# EAGLE schematic HYBRID_COMPUTER (EAGLE 7.7.0)

## Sheet 1 of 2
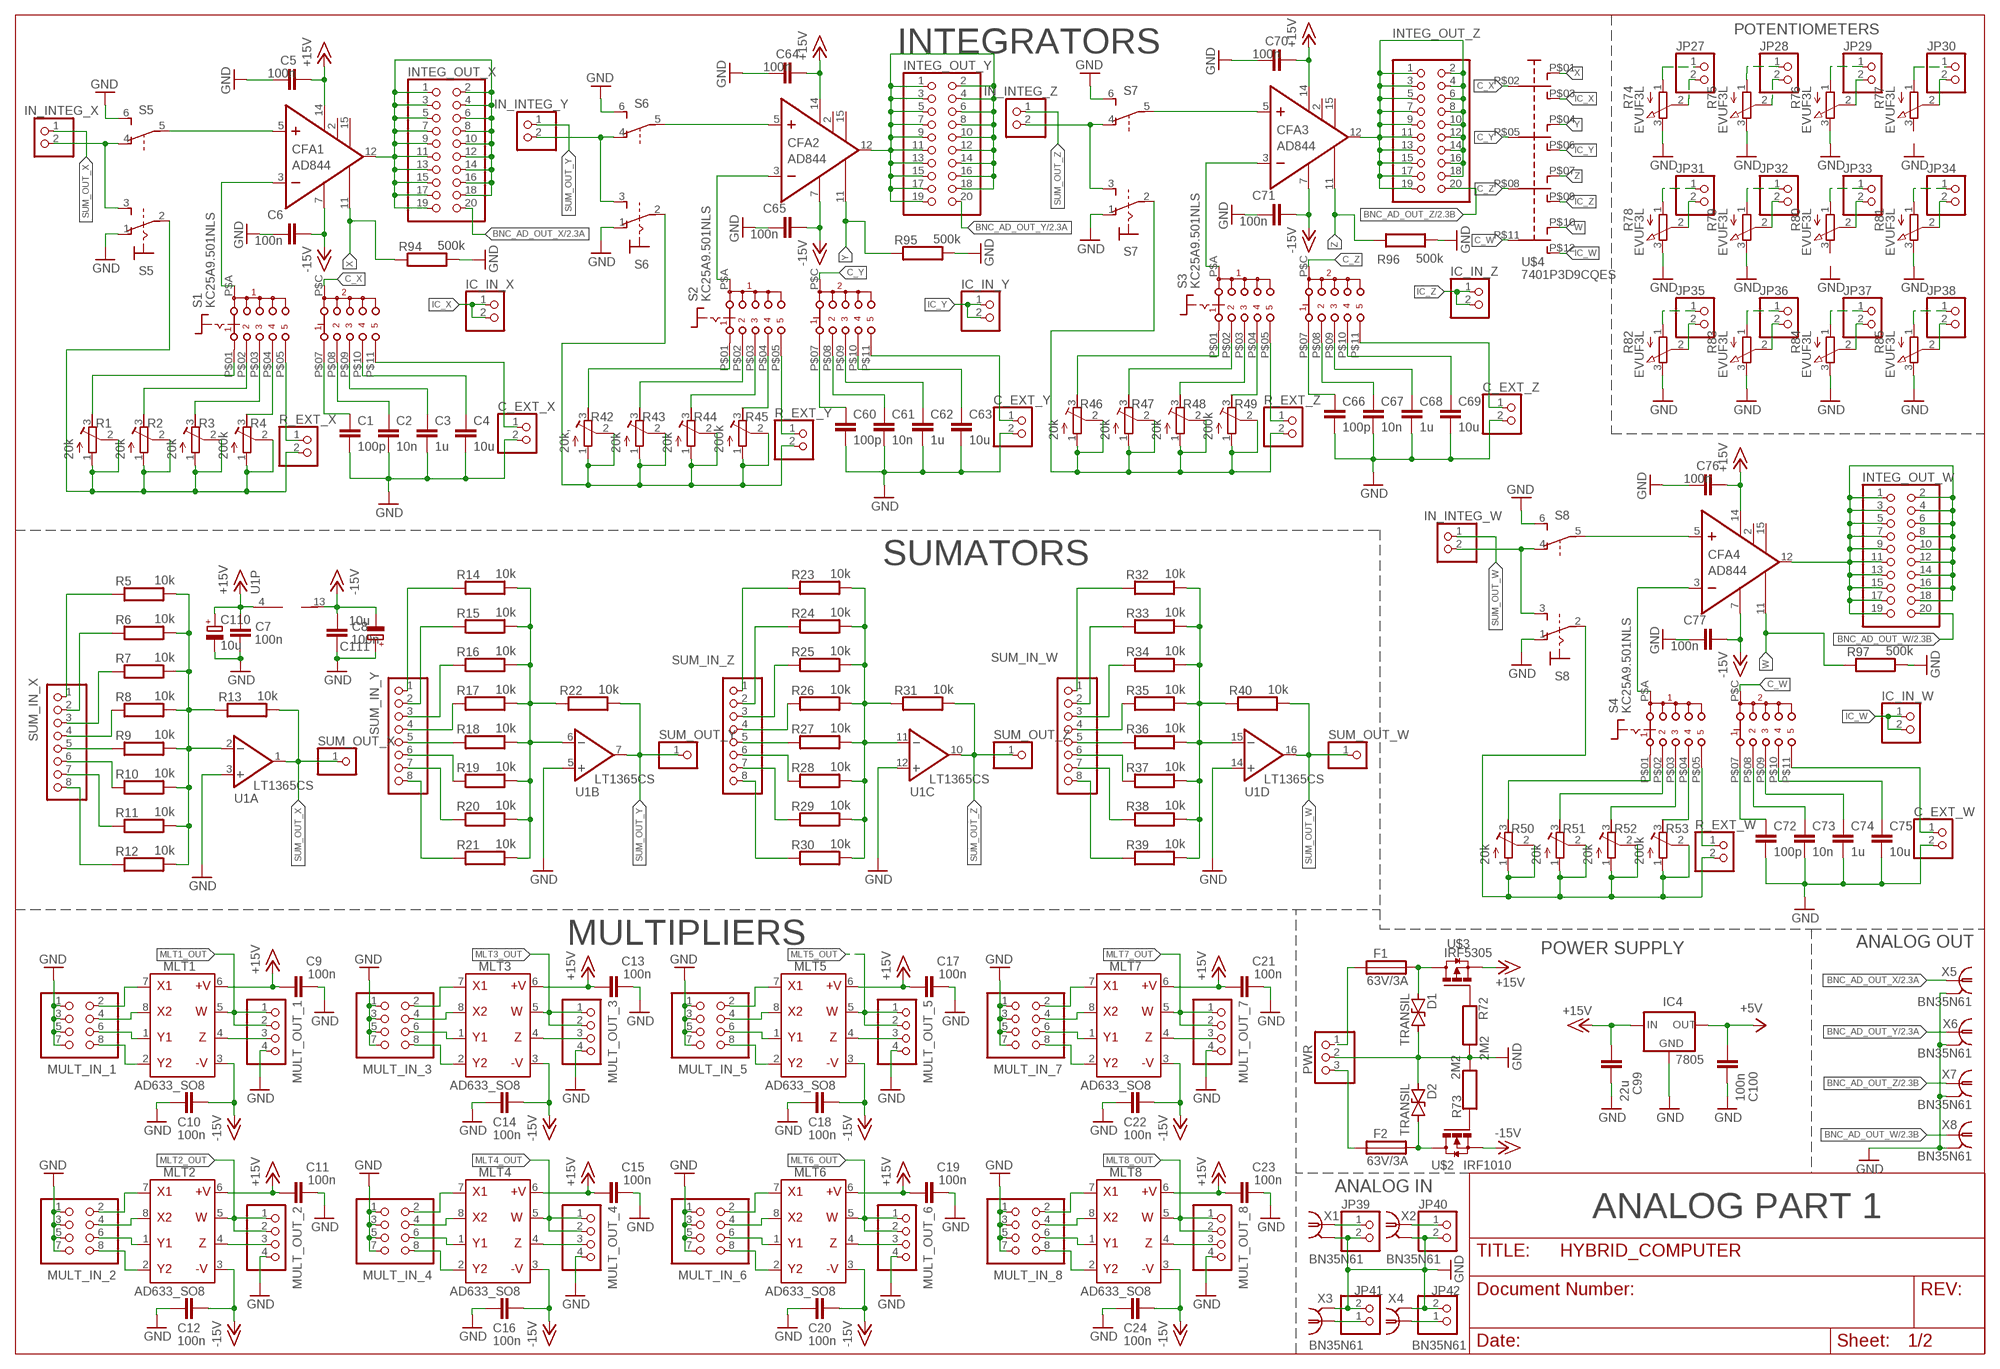
[diagram p0: schematic, sheet 1]

### Parts
C1  100p  C_1206  [C_1206]
C2  10n  C_1206  [C_1206]
C3  1u  C_1206  [C_1206]
C4  10u  C_1206  [C_1206]
C5  100n  C_1206  [C_1206]
C6  100n  C_1206  [C_1206]
C7  100n  C_1206  [C_1206]
C8  100n  C_1206  [C_1206]
C9  100n  C_1206  [C_1206]
C10  100n  C_1206  [C_1206]
C11  100n  C_1206  [C_1206]
C12  100n  C_1206  [C_1206]
C13  100n  C_1206  [C_1206]
C14  100n  C_1206  [C_1206]
C15  100n  C_1206  [C_1206]
C16  100n  C_1206  [C_1206]
C17  100n  C_1206  [C_1206]
C18  100n  C_1206  [C_1206]
C19  100n  C_1206  [C_1206]
C20  100n  C_1206  [C_1206]
C21  100n  C_1206  [C_1206]
C22  100n  C_1206  [C_1206]
C23  100n  C_1206  [C_1206]
C24  100n  C_1206  [C_1206]
C60  100p  C_1206  [C_1206]
C61  10n  C_1206  [C_1206]
C62  1u  C_1206  [C_1206]
C63  10u  C_1206  [C_1206]
C64  100n  C_1206  [C_1206]
C65  100n  C_1206  [C_1206]
C66  100p  C_1206  [C_1206]
C67  10n  C_1206  [C_1206]
C68  1u  C_1206  [C_1206]
C69  10u  C_1206  [C_1206]
C70  100n  C_1206  [C_1206]
C71  100n  C_1206  [C_1206]
C72  100p  C_1206  [C_1206]
C73  10n  C_1206  [C_1206]
C74  1u  C_1206  [C_1206]
C75  10u  C_1206  [C_1206]
C76  100n  C_1206  [C_1206]
C77  100n  C_1206  [C_1206]
C99  22u  C_1206  [C_1206]
C100  100n  C_1206  [C_1206]
C110  10u  CPOL-EUE2.5-5  [E2,5-5]
C111  10u  CPOL-EUE2.5-5  [E2,5-5]
C_EXT_W  PINHD-1X2  [1X02]
C_EXT_X  PINHD-1X2  [1X02]
C_EXT_Y  PINHD-1X2  [1X02]
C_EXT_Z  PINHD-1X2  [1X02]
CFA1  AD844  AD844_SOIC16R  [SOIC16R]
CFA2  AD844  AD844_SOIC16R  [SOIC16R]
CFA3  AD844  AD844_SOIC16R  [SOIC16R]
CFA4  AD844  AD844_SOIC16R  [SOIC16R]
D1  TRANSIL  [DO15-12]
D2  TRANSIL  [DO15-12]
F1  63V/3A  FUSE  [FUSE_1206]
F2  63V/3A  FUSE  [FUSE_1206]
IC4  7805  78MXXS  [78MXXS]
IC_IN_W  PINHD-1X2  [1X02]
IC_IN_X  PINHD-1X2  [1X02]
IC_IN_Y  PINHD-1X2  [1X02]
IC_IN_Z  PINHD-1X2  [1X02]
IN_INTEG_W  PINHD-1X2  [1X02]
IN_INTEG_X  PINHD-1X2  [1X02]
IN_INTEG_Y  PINHD-1X2  [1X02]
IN_INTEG_Z  PINHD-1X2  [1X02]
INTEG_OUT_W  PINHD-2X10  [2X10]
INTEG_OUT_X  PINHD-2X10  [2X10]
INTEG_OUT_Y  PINHD-2X10  [2X10]
INTEG_OUT_Z  PINHD-2X10  [2X10]
JP27  PINHD-1X2  [1X02]
JP28  PINHD-1X2  [1X02]
JP29  PINHD-1X2  [1X02]
JP30  PINHD-1X2  [1X02]
JP31  PINHD-1X2  [1X02]
JP32  PINHD-1X2  [1X02]
JP33  PINHD-1X2  [1X02]
JP34  PINHD-1X2  [1X02]
JP35  PINHD-1X2  [1X02]
JP36  PINHD-1X2  [1X02]
JP37  PINHD-1X2  [1X02]
JP38  PINHD-1X2  [1X02]
JP39  PINHD-1X2  [1X02]
JP40  PINHD-1X2  [1X02]
JP41  PINHD-1X2  [1X02]
JP42  PINHD-1X2  [1X02]
MLT1  AD633_SO8  [SO8]
MLT2  AD633_SO8  [SO8]
MLT3  AD633_SO8  [SO8]
MLT4  AD633_SO8  [SO8]
MLT5  AD633_SO8  [SO8]
MLT6  AD633_SO8  [SO8]
MLT7  AD633_SO8  [SO8]
MLT8  AD633_SO8  [SO8]
MULT_IN_1  PINHD-2X4  [2X04]
MULT_IN_2  PINHD-2X4  [2X04]
MULT_IN_3  PINHD-2X4  [2X04]
MULT_IN_4  PINHD-2X4  [2X04]
MULT_IN_5  PINHD-2X4  [2X04]
MULT_IN_6  PINHD-2X4  [2X04]
MULT_IN_7  PINHD-2X4  [2X04]
MULT_IN_8  PINHD-2X4  [2X04]
MULT_OUT_1  PINHD-1X4  [1X04]
MULT_OUT_2  PINHD-1X4  [1X04]
MULT_OUT_3  PINHD-1X4  [1X04]
MULT_OUT_4  PINHD-1X4  [1X04]
MULT_OUT_5  PINHD-1X4  [1X04]
MULT_OUT_6  PINHD-1X4  [1X04]
MULT_OUT_7  PINHD-1X4  [1X04]
MULT_OUT_8  PINHD-1X4  [1X04]
PWR  PINHD-1X3  [1X03]
R1  20k  R-TRIMM64W  [RTRIM64W]
R2  20k  R-TRIMM64W  [RTRIM64W]
R3  20k  R-TRIMM64W  [RTRIM64W]
R4  200k  R-TRIMM64W  [RTRIM64W]
R5  10k  R_1206  [R_1206]
R6  10k  R_1206  [R_1206]
R7  10k  R_1206  [R_1206]
R8  10k  R_1206  [R_1206]
R9  10k  R_1206  [R_1206]
R10  10k  R_1206  [R_1206]
R11  10k  R_1206  [R_1206]
R12  10k  R_1206  [R_1206]
R13  10k  R_1206  [R_1206]
R14  10k  R_1206  [R_1206]
R15  10k  R_1206  [R_1206]
R16  10k  R_1206  [R_1206]
R17  10k  R_1206  [R_1206]
R18  10k  R_1206  [R_1206]
R19  10k  R_1206  [R_1206]
R20  10k  R_1206  [R_1206]
R21  10k  R_1206  [R_1206]
R22  10k  R_1206  [R_1206]
R23  10k  R_1206  [R_1206]
R24  10k  R_1206  [R_1206]
R25  10k  R_1206  [R_1206]
R26  10k  R_1206  [R_1206]
R27  10k  R_1206  [R_1206]
R28  10k  R_1206  [R_1206]
R29  10k  R_1206  [R_1206]
R30  10k  R_1206  [R_1206]
R31  10k  R_1206  [R_1206]
R32  10k  R_1206  [R_1206]
R33  10k  R_1206  [R_1206]
R34  10k  R_1206  [R_1206]
R35  10k  R_1206  [R_1206]
R36  10k  R_1206  [R_1206]
R37  10k  R_1206  [R_1206]
R38  10k  R_1206  [R_1206]
R39  10k  R_1206  [R_1206]
R40  10k  R_1206  [R_1206]
R42  20k,  R-TRIMM64W  [RTRIM64W]
R43  20k  R-TRIMM64W  [RTRIM64W]
R44  20k  R-TRIMM64W  [RTRIM64W]
R45  200k  R-TRIMM64W  [RTRIM64W]
R46  20k  R-TRIMM64W  [RTRIM64W]
R47  20k  R-TRIMM64W  [RTRIM64W]
R48  20k  R-TRIMM64W  [RTRIM64W]
R49  200k  R-TRIMM64W  [RTRIM64W]
R50  20k  R-TRIMM64W  [RTRIM64W]
R51  20k  R-TRIMM64W  [RTRIM64W]
R52  20k  R-TRIMM64W  [RTRIM64W]
R53  200k  R-TRIMM64W  [RTRIM64W]
R72  2M2  R_1206  [R_1206]
R73  2M2  R_1206  [R_1206]
R74  EVUF3L  [EVUFXL]
R75  EVUF3L  [EVUFXL]
R76  EVUF3L  [EVUFXL]
R77  EVUF3L  [EVUFXL]
R78  EVUF3L  [EVUFXL]
R79  EVUF3L  [EVUFXL]
R80  EVUF3L  [EVUFXL]
R81  EVUF3L  [EVUFXL]
R82  EVUF3L  [EVUFXL]
R83  EVUF3L  [EVUFXL]
R84  EVUF3L  [EVUFXL]
R85  EVUF3L  [EVUFXL]
R94  500k  R_1206  [R_1206]
R95  500k  R_1206  [R_1206]
R96  500k  R_1206  [R_1206]
R97  500k  R_1206  [R_1206]
R_EXT_W  PINHD-1X2  [1X02]
R_EXT_X  PINHD-1X2  [1X02]
R_EXT_Y  PINHD-1X2  [1X02]
R_EXT_Z  PINHD-1X2  [1X02]
S1  KC25A9.501NLS  [KC25A9.501NLS]
S2  KC25A9.501NLS  [KC25A9.501NLS]
S3  KC25A9.501NLS  [KC25A9.501NLS]
S4  KC25A9.501NLS  [KC25A9.501NLS]
S5  320-938  [320-938]
S6  320-938  [320-938]
S7  320-938  [320-938]
S8  320-938  [320-938]
SUM_IN_W  PINHD-1X8  [1X08]
SUM_IN_X  PINHD-1X8  [1X08]
SUM_IN_Y  PINHD-1X8  [1X08]
SUM_IN_Z  PINHD-1X8  [1X08]
SUM_OUT_W  PINHD-1X1  [1X01]
SUM_OUT_X  PINHD-1X1  [1X01]
SUM_OUT_Y  PINHD-1X1  [1X01]
SUM_OUT_Z  PINHD-1X1  [1X01]
U1  LT1365CS  [SO16]
U$2  IRF1010  [TO220BV]
U$3  IRF5305  [TO220BV]
U$4  7401P3D9CQES  [7401P3D9CQES]
X1  BN35N61  [B35N61]
X2  BN35N61  [B35N61]
X3  BN35N61  [B35N61]
X4  BN35N61  [B35N61]
X5  BN35N61  [B35N61]
X6  BN35N61  [B35N61]
X7  BN35N61  [B35N61]
X8  BN35N61  [B35N61]

### Nets
+5V: C100.1 IC4.OUT ; also sheet 2
+15V: C5.1 C7.1 C9.1 C11.1 C13.1 C15.1 C17.1 C19.1 C21.1 C23.1 C64.1 C70.1 C76.1 C99.1 C110.+ CFA1.14 CFA2.14 CFA3.14 CFA4.14 IC4.IN MLT1.6 MLT2.6 MLT3.6 MLT4.6 MLT5.6 MLT6.6 MLT7.6 MLT8.6 U1.4(P:V+) U$3.S ; also sheet 2
-15V: C6.1 C8.1 C10.1 C12.1 C14.1 C16.1 C18.1 C20.1 C22.1 C24.1 C65.1 C71.1 C77.1 C111.- CFA1.7 CFA2.7 CFA3.7 CFA4.7 MLT1.3 MLT2.3 MLT3.3 MLT4.3 MLT5.3 MLT6.3 MLT7.3 MLT8.3 U1.13(P:V-) U$2.S ; also sheet 2
BNC_AD_OUT_W: INTEG_OUT_W.20 X8.1 ; also sheet 2
BNC_AD_OUT_X: INTEG_OUT_X.20 X5.1 ; also sheet 2
BNC_AD_OUT_Y: INTEG_OUT_Y.20 X6.1 ; also sheet 2
BNC_AD_OUT_Z: INTEG_OUT_Z.20 X7.1 ; also sheet 2
C_W: S4.P$C(C) U$4.P$11
C_X: S1.P$C(C) U$4.P$02
C_Y: S2.P$C(C) U$4.P$05
C_Z: S3.P$C(C) U$4.P$08
GND: C1.2 C2.2 C3.2 C4.2 C5.2 C6.2 C7.2 C8.2 C9.2 C10.2 C11.2 C12.2 C13.2 C14.2 C15.2 C16.2 C17.2 C18.2 C19.2 C20.2 C21.2 C22.2 C23.2 C24.2 C60.2 C61.2 C62.2 C63.2 C64.2 C65.2 C66.2 C67.2 C68.2 C69.2 C70.2 C71.2 C72.2 C73.2 C74.2 C75.2 C76.2 C77.2 C99.2 C100.2 C110.- C111.+ C_EXT_W.2 C_EXT_X.2 C_EXT_Y.2 C_EXT_Z.2 D1.C D2.A IC4.GND JP39.2 JP40.2 JP41.2 JP42.2 MULT_IN_1.1 MULT_IN_1.3 MULT_IN_1.5 MULT_IN_1.7 MULT_IN_2.1 MULT_IN_2.3 MULT_IN_2.5 MULT_IN_2.7 MULT_IN_3.1 MULT_IN_3.3 MULT_IN_3.5 MULT_IN_3.7 MULT_IN_4.1 MULT_IN_4.3 MULT_IN_4.5 MULT_IN_4.7 MULT_IN_5.1 MULT_IN_5.3 MULT_IN_5.5 MULT_IN_5.7 MULT_IN_6.1 MULT_IN_6.3 MULT_IN_6.5 MULT_IN_6.7 MULT_IN_7.1 MULT_IN_7.3 MULT_IN_7.5 MULT_IN_7.7 MULT_IN_8.1 MULT_IN_8.3 MULT_IN_8.5 MULT_IN_8.7 MULT_OUT_1.4 MULT_OUT_2.4 MULT_OUT_3.4 MULT_OUT_4.4 MULT_OUT_5.4 MULT_OUT_6.4 MULT_OUT_7.4 MULT_OUT_8.4 PWR.2 R72.2 R73.2 R74.3(E) R75.3(E) R76.3(E) R78.3(E) R79.3(E) R81.3(E) R82.3(E) R83.3(E) R84.3(E) R85.3(E) R94.2 R95.2 R96.2 R97.2 S5.1(1:O) S5.6(B:S) S6.1(1:O) S6.6(B:S) S7.1(1:O) S7.6(B:S) S8.1(1:O) S8.6(B:S) U1.3(A:+IN) U1.5(B:+IN) U1.12(C:+IN) U1.14(D:+IN) X1.2 X1.3 X1.4 X1.5 X2.2 X2.3 X2.4 X2.5 X3.2 X3.3 X3.4 X3.5 X4.2 X4.3 X4.4 X4.5 X5.2 X5.3 X5.4 X5.5 X6.2 X6.3 X6.4 X6.5 X7.2 X7.3 X7.4 X7.5 X8.2 X8.3 X8.4 X8.5 ; also sheet 2
IC_W: IC_IN_W.1 IC_IN_W.2 U$4.P$12
IC_X: IC_IN_X.1 IC_IN_X.2 U$4.P$03
IC_Y: IC_IN_Y.1 IC_IN_Y.2 U$4.P$06
IC_Z: IC_IN_Z.1 IC_IN_Z.2 U$4.P$09
INTEG_OUT_W: CFA4.12 INTEG_OUT_W.1 INTEG_OUT_W.2 INTEG_OUT_W.3 INTEG_OUT_W.4 INTEG_OUT_W.5 INTEG_OUT_W.6 INTEG_OUT_W.7 INTEG_OUT_W.8 INTEG_OUT_W.9 INTEG_OUT_W.10 INTEG_OUT_W.11 INTEG_OUT_W.12 INTEG_OUT_W.13 INTEG_OUT_W.14 INTEG_OUT_W.15 INTEG_OUT_W.16 INTEG_OUT_W.17 INTEG_OUT_W.18 INTEG_OUT_W.19
INTEG_OUT_Y: CFA2.12 INTEG_OUT_Y.1 INTEG_OUT_Y.2 INTEG_OUT_Y.3 INTEG_OUT_Y.4 INTEG_OUT_Y.5 INTEG_OUT_Y.6 INTEG_OUT_Y.7 INTEG_OUT_Y.8 INTEG_OUT_Y.9 INTEG_OUT_Y.10 INTEG_OUT_Y.11 INTEG_OUT_Y.12 INTEG_OUT_Y.13 INTEG_OUT_Y.14 INTEG_OUT_Y.15 INTEG_OUT_Y.16 INTEG_OUT_Y.17 INTEG_OUT_Y.18 INTEG_OUT_Y.19
INTEG_OUT_Z: CFA3.12 INTEG_OUT_Z.1 INTEG_OUT_Z.2 INTEG_OUT_Z.3 INTEG_OUT_Z.4 INTEG_OUT_Z.5 INTEG_OUT_Z.6 INTEG_OUT_Z.7 INTEG_OUT_Z.8 INTEG_OUT_Z.9 INTEG_OUT_Z.10 INTEG_OUT_Z.11 INTEG_OUT_Z.12 INTEG_OUT_Z.13 INTEG_OUT_Z.14 INTEG_OUT_Z.15 INTEG_OUT_Z.16 INTEG_OUT_Z.17 INTEG_OUT_Z.18 INTEG_OUT_Z.19
MLT1_OUT: MLT1.5 MULT_OUT_1.1 MULT_OUT_1.2
MLT2_OUT: MLT2.5 MULT_OUT_2.1 MULT_OUT_2.2
MLT3_OUT: MLT3.5 MULT_OUT_3.1 MULT_OUT_3.2
MLT4_OUT: MLT4.5 MULT_OUT_4.1 MULT_OUT_4.2
MLT5_OUT: MLT5.5 MULT_OUT_5.1 MULT_OUT_5.2
MLT6_OUT: MLT6.5 MULT_OUT_6.1 MULT_OUT_6.2
MLT7_OUT: MLT7.5 MULT_OUT_7.1 MULT_OUT_7.2
MLT8_OUT: MLT8.5 MULT_OUT_8.1 MULT_OUT_8.2
N$1: R1.1(A) R1.2(S) R2.1(A) R2.2(S) R3.1(A) R3.2(S) R4.1(A) R4.2(S) R_EXT_X.2 S5.2(1:P)
N$2: CFA1.5 S5.5(B:P)
N$3: CFA1.3 S1.P$A(A)
N$4: IN_INTEG_X.2 S5.3(1:S) S5.4(B:O)
N$6: R4.3(E) S1.P$04
N$8: R1.3(E) S1.P$01
N$9: R2.3(E) S1.P$02
N$10: R3.3(E) S1.P$03
N$11: C1.1 S1.P$07
N$12: R5.2 R6.2 R7.2 R8.2 R9.2 R10.2 R11.2 R12.2 R13.1 U1.2(A:-IN)
N$13: C4.1 S1.P$10
N$14: C3.1 S1.P$09
N$15: C2.1 S1.P$08
N$17: R_EXT_X.1 S1.P$05
N$19: R9.1 SUM_IN_X.5
N$20: C_EXT_X.1 S1.P$11
N$21: R10.1 SUM_IN_X.6
N$22: R11.1 SUM_IN_X.7
N$23: R12.1 SUM_IN_X.8
N$24: R8.1 SUM_IN_X.4
N$25: R7.1 SUM_IN_X.3
N$26: R6.1 SUM_IN_X.2
N$27: R5.1 SUM_IN_X.1
N$28: R14.2 R15.2 R16.2 R17.2 R18.2 R19.2 R20.2 R21.2 R22.1 U1.6(B:-IN)
N$29: JP29.2 R76.2(S)
N$30: R18.1 SUM_IN_Y.5
N$31: R19.1 SUM_IN_Y.6
N$32: R20.1 SUM_IN_Y.7
N$33: R21.1 SUM_IN_Y.8
N$34: R17.1 SUM_IN_Y.4
N$35: R16.1 SUM_IN_Y.3
N$36: R15.1 SUM_IN_Y.2
N$37: R14.1 SUM_IN_Y.1
N$38: R23.2 R24.2 R25.2 R26.2 R27.2 R28.2 R29.2 R30.2 R31.1 U1.11(C:-IN)
N$39: MLT1.7 MULT_IN_1.2
N$40: R27.1 SUM_IN_Z.5
N$41: R28.1 SUM_IN_Z.6
N$42: R29.1 SUM_IN_Z.7
N$43: R30.1 SUM_IN_Z.8
N$44: R26.1 SUM_IN_Z.4
N$45: R25.1 SUM_IN_Z.3
N$46: R24.1 SUM_IN_Z.2
N$47: R23.1 SUM_IN_Z.1
N$48: R32.2 R33.2 R34.2 R35.2 R36.2 R37.2 R38.2 R39.2 R40.1 U1.15(D:-IN)
N$50: R36.1 SUM_IN_W.5
N$51: R37.1 SUM_IN_W.6
N$52: R38.1 SUM_IN_W.7
N$53: R39.1 SUM_IN_W.8
N$54: R35.1 SUM_IN_W.4
N$55: R34.1 SUM_IN_W.3
N$56: R33.1 SUM_IN_W.2
N$57: R32.1 SUM_IN_W.1
N$59: MLT1.4 MULT_OUT_1.3
N$60: MLT1.8 MULT_IN_1.4
N$61: MLT1.1 MULT_IN_1.6
N$62: MLT1.2 MULT_IN_1.8
N$64: MLT2.4 MULT_OUT_2.3
N$65: MLT2.7 MULT_IN_2.2
N$66: MLT2.8 MULT_IN_2.4
N$67: MLT2.1 MULT_IN_2.6
N$68: MLT2.2 MULT_IN_2.8
N$70: MLT3.4 MULT_OUT_3.3
N$71: MLT3.7 MULT_IN_3.2
N$72: MLT3.8 MULT_IN_3.4
N$73: MLT3.1 MULT_IN_3.6
N$74: MLT3.2 MULT_IN_3.8
N$75: R46.1(A) R46.2(S) R47.1(A) R47.2(S) R48.1(A) R48.2(S) R49.1(A) R49.2(S) R_EXT_Z.2 S7.2(1:P)
N$76: MLT4.4 MULT_OUT_4.3
N$77: MLT4.7 MULT_IN_4.2
N$78: MLT4.8 MULT_IN_4.4
N$79: MLT4.1 MULT_IN_4.6
N$80: MLT4.2 MULT_IN_4.8
N$82: MLT5.4 MULT_OUT_5.3
N$83: MLT5.7 MULT_IN_5.2
N$84: MLT5.8 MULT_IN_5.4
N$85: MLT5.1 MULT_IN_5.6
N$86: MLT5.2 MULT_IN_5.8
N$88: MLT6.4 MULT_OUT_6.3
N$89: MLT6.7 MULT_IN_6.2
N$90: MLT6.8 MULT_IN_6.4
N$91: MLT6.1 MULT_IN_6.6
N$92: MLT6.2 MULT_IN_6.8
N$94: MLT7.4 MULT_OUT_7.3
N$95: MLT7.7 MULT_IN_7.2
N$96: MLT7.8 MULT_IN_7.4
N$97: MLT7.1 MULT_IN_7.6
N$98: MLT7.2 MULT_IN_7.8
N$100: MLT8.4 MULT_OUT_8.3
N$101: MLT8.7 MULT_IN_8.2
N$102: MLT8.8 MULT_IN_8.4
N$103: MLT8.1 MULT_IN_8.6
N$104: MLT8.2 MULT_IN_8.8
N$106: JP27.1 R74.1(A)
N$107: JP27.2 R74.2(S)
N$108: JP28.2 R75.2(S)
N$109: JP28.1 R75.1(A)
N$110: JP29.1 R76.1(A)
N$112: JP30.1 R77.1(A)
N$113: JP30.2 R77.2(S)
N$114: JP34.1 R81.1(A)
N$115: JP34.2 R81.2(S)
N$116: JP33.2 R80.2(S)
N$117: JP33.1 R80.1(A)
N$118: JP32.1 R79.1(A)
N$119: JP32.2 R79.2(S)
N$120: JP31.1 R78.1(A)
N$121: JP31.2 R78.2(S)
N$122: JP35.1 R82.1(A)
N$123: JP35.2 R82.2(S)
N$124: JP36.1 R83.1(A)
N$125: JP36.2 R83.2(S)
N$126: JP37.1 R84.1(A)
N$127: JP37.2 R84.2(S)
N$128: JP38.1 R85.1(A)
N$129: JP38.2 R85.2(S)
N$133: D1.A F1.2 U$3.D
N$141: R42.1(A) R42.2(S) R43.1(A) R43.2(S) R44.1(A) R44.2(S) R45.1(A) R45.2(S) R_EXT_Y.2 S6.2(1:P)
N$142: CFA2.5 S6.5(B:P)
N$143: CFA2.3 S2.P$A(A)
N$144: IN_INTEG_Y.2 S6.3(1:S) S6.4(B:O)
N$145: R42.3(E) S2.P$01
N$146: R43.3(E) S2.P$02
N$147: R44.3(E) S2.P$03
N$148: C63.1 S2.P$10
N$149: C62.1 S2.P$09
N$150: C61.1 S2.P$08
N$153: CFA1.12 INTEG_OUT_X.1 INTEG_OUT_X.2 INTEG_OUT_X.3 INTEG_OUT_X.4 INTEG_OUT_X.5 INTEG_OUT_X.6 INTEG_OUT_X.7 INTEG_OUT_X.8 INTEG_OUT_X.9 INTEG_OUT_X.10 INTEG_OUT_X.11 INTEG_OUT_X.12 INTEG_OUT_X.13 INTEG_OUT_X.14 INTEG_OUT_X.15 INTEG_OUT_X.16 INTEG_OUT_X.17 INTEG_OUT_X.18 INTEG_OUT_X.19
N$154: R45.3(E) S2.P$04
N$155: C60.1 S2.P$07
N$156: R_EXT_Y.1 S2.P$05
N$157: C_EXT_Y.1 S2.P$11
N$159: CFA3.5 S7.5(B:P)
N$160: CFA3.3 S3.P$A(A)
N$161: IN_INTEG_Z.2 S7.3(1:S) S7.4(B:O)
N$162: R46.3(E) S3.P$01
N$163: R47.3(E) S3.P$02
N$164: R48.3(E) S3.P$03
N$165: C69.1 S3.P$10
N$166: C68.1 S3.P$09
N$167: C67.1 S3.P$08
N$171: R49.3(E) S3.P$04
N$172: C66.1 S3.P$07
N$173: R_EXT_Z.1 S3.P$05
N$174: C_EXT_Z.1 S3.P$11
N$175: R50.1(A) R50.2(S) R51.1(A) R51.2(S) R52.1(A) R52.2(S) R53.1(A) R53.2(S) R_EXT_W.2 S8.2(1:P)
N$176: CFA4.5 S8.5(B:P)
N$177: CFA4.3 S4.P$A(A)
N$178: IN_INTEG_W.2 S8.3(1:S) S8.4(B:O)
N$179: R50.3(E) S4.P$01
N$180: R51.3(E) S4.P$02
N$181: R52.3(E) S4.P$03
N$182: C75.1 S4.P$10
N$183: C74.1 S4.P$09
N$184: C73.1 S4.P$08
N$188: R53.3(E) S4.P$04
N$189: C72.1 S4.P$07
N$190: R_EXT_W.1 S4.P$05
N$191: C_EXT_W.1 S4.P$11
N$202: F2.1 PWR.3
N$203: F1.1 PWR.1
N$204: JP39.1 X1.1
N$206: JP40.1 X2.1
N$208: JP41.1 X3.1
N$210: JP42.1 X4.1
N$220: D2.C F2.2 U$2.D
N$222: R72.1 U$3.G
N$223: R73.1 U$2.G
SUM_OUT_W: IN_INTEG_W.1 R40.2 SUM_OUT_W.1 U1.16(D:OUT)
SUM_OUT_X: IN_INTEG_X.1 R13.2 SUM_OUT_X.1 U1.1(A:OUT)
SUM_OUT_Y: IN_INTEG_Y.1 R22.2 SUM_OUT_Y.1 U1.7(B:OUT)
SUM_OUT_Z: IN_INTEG_Z.1 R31.2 SUM_OUT_Z.1 U1.10(C:OUT)
W: CFA4.11 R97.1 U$4.P$10
X: CFA1.11 R94.1 U$4.P$01
Y: CFA2.11 R95.1 U$4.P$04
Z: CFA3.11 R96.1 U$4.P$07
Unconnected: CFA1.2 CFA1.15 CFA2.2 CFA2.15 CFA3.2 CFA3.15 CFA4.2 CFA4.15 R77.3(E) R80.3(E)

### Notes on the sheet
- POTENTIOMETERS
- INTEGRATORS
- SUMATORS
- MULTIPLIERS | ANALOG OUT
- POWER SUPPLY
- ANALOG IN
- ANALOG PART 1

## Sheet 2 of 2
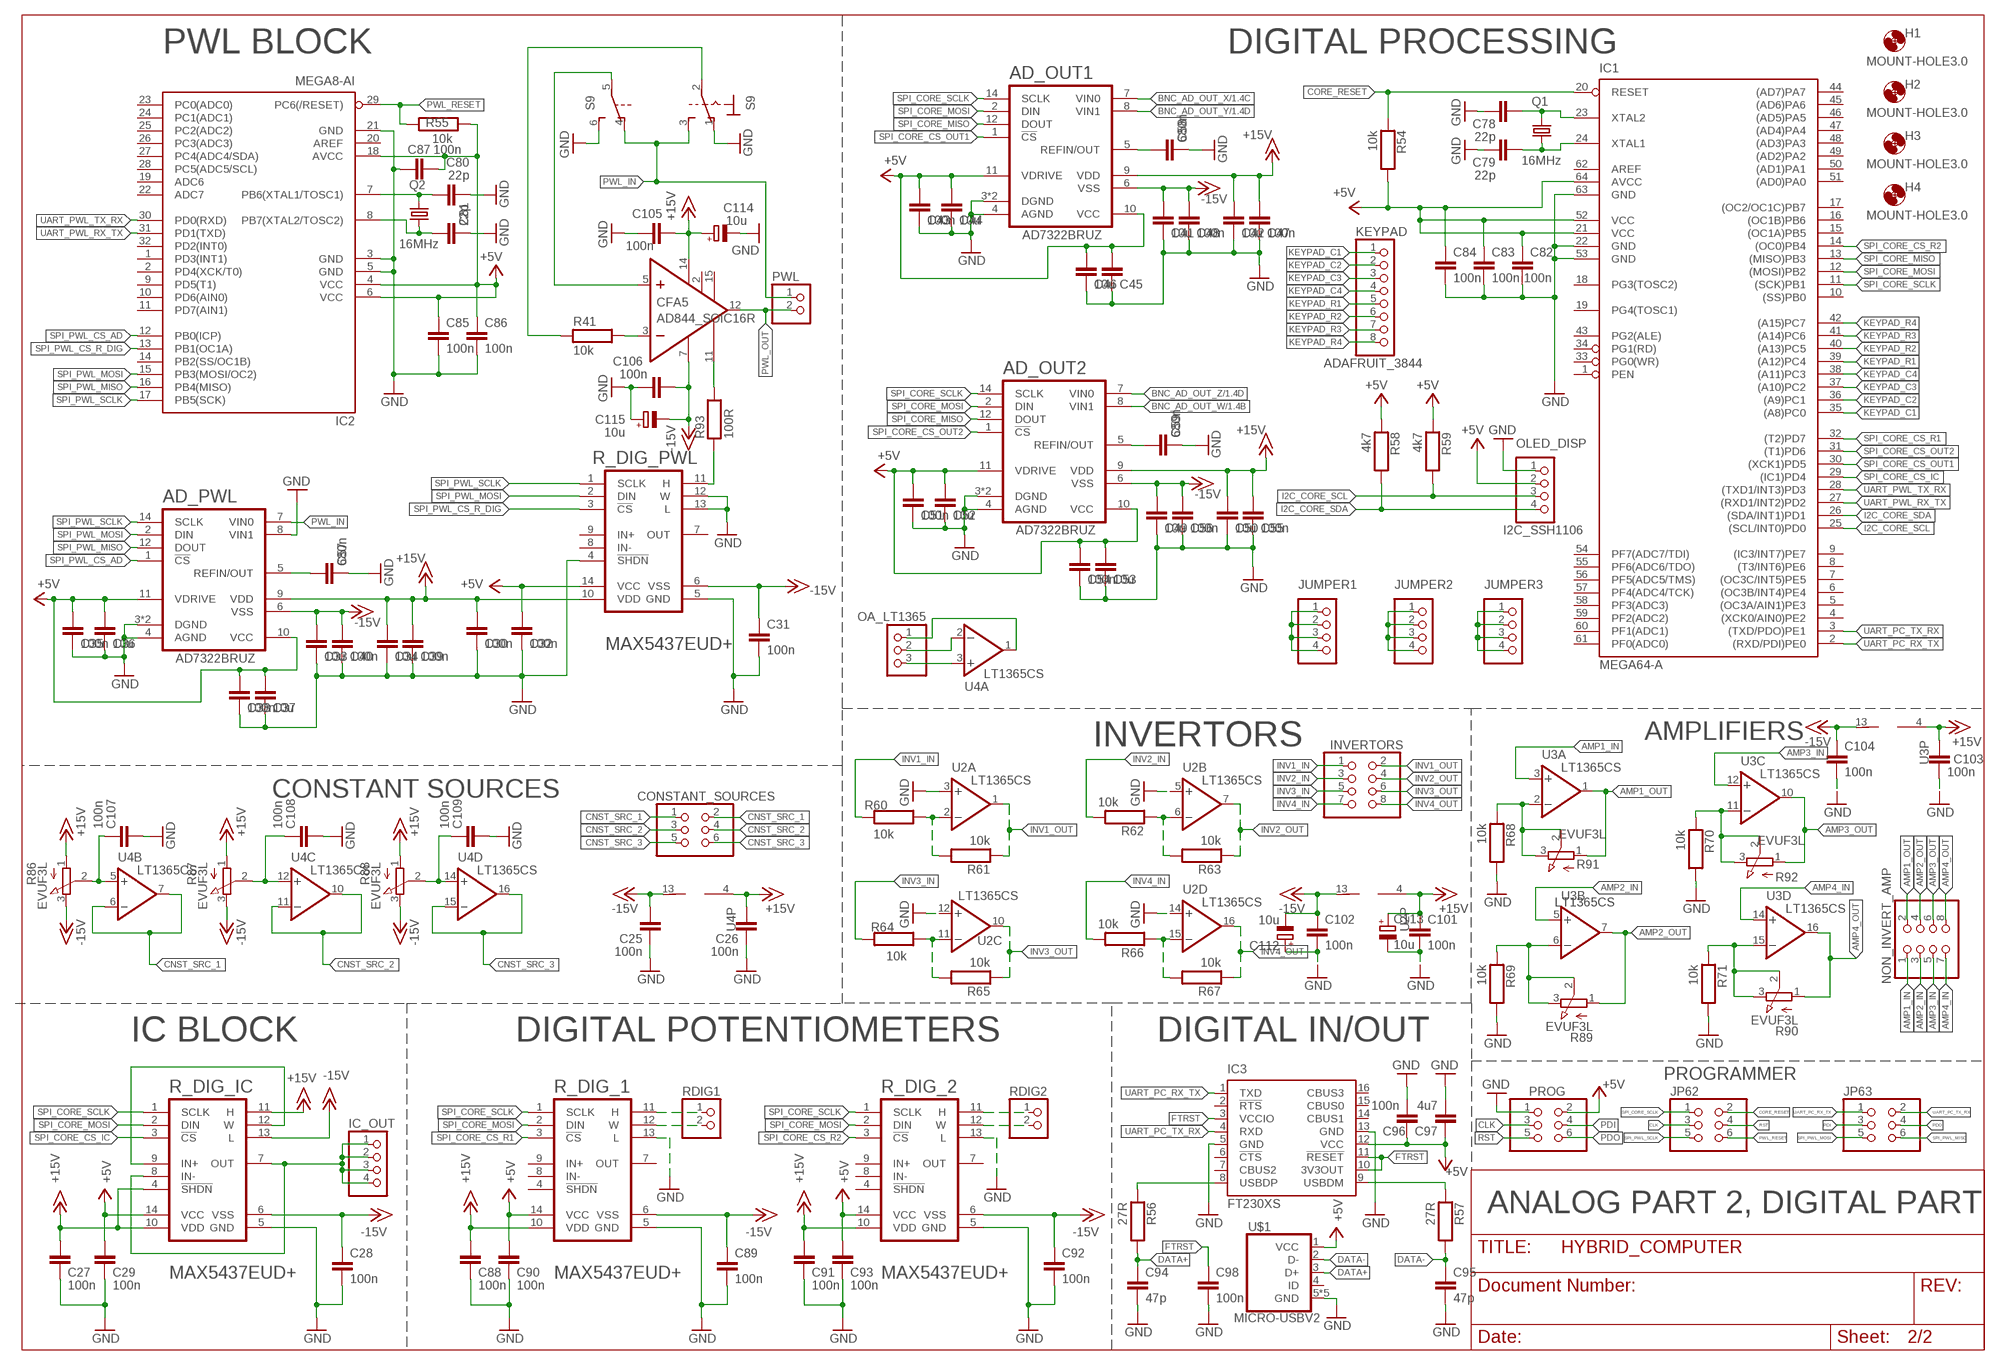
[diagram p1: schematic, sheet 2]

### Parts
AD_OUT1  AD7322  [TSSOP-14]
AD_OUT2  AD7322  [TSSOP-14]
AD_PWL  AD7322  [TSSOP-14]
C25  100n  C_1206  [C_1206]
C26  100n  C_1206  [C_1206]
C27  100n  C_1206  [C_1206]
C28  100n  C_1206  [C_1206]
C29  100n  C_1206  [C_1206]
C30  100n  C_1206  [C_1206]
C31  100n  C_1206  [C_1206]
C32  100n  C_1206  [C_1206]
C33  10u  C_1206  [C_1206]
C34  10u  C_1206  [C_1206]
C35  100n  C_1206  [C_1206]
C36  10u  C_1206  [C_1206]
C37  10u  C_1206  [C_1206]
C38  100n  C_1206  [C_1206]
C39  100n  C_1206  [C_1206]
C40  100n  C_1206  [C_1206]
C41  10u  C_1206  [C_1206]
C42  10u  C_1206  [C_1206]
C43  100n  C_1206  [C_1206]
C44  10u  C_1206  [C_1206]
C45  C_1206  [C_1206]
C46  10u  C_1206  [C_1206]
C47  100n  C_1206  [C_1206]
C48  100n  C_1206  [C_1206]
C49  10u  C_1206  [C_1206]
C50  10u  C_1206  [C_1206]
C51  100n  C_1206  [C_1206]
C52  10u  C_1206  [C_1206]
C53  10u  C_1206  [C_1206]
C54  100n  C_1206  [C_1206]
C55  100n  C_1206  [C_1206]
C56  100n  C_1206  [C_1206]
C57  680n  C_1206  [C_1206]
C58  680n  C_1206  [C_1206]
C59  680n  C_1206  [C_1206]
C78  22p  C_1206  [C_1206]
C79  22p  C_1206  [C_1206]
C80  22p  C_1206  [C_1206]
C81  22p  C_1206  [C_1206]
C82  100n  C_1206  [C_1206]
C83  100n  C_1206  [C_1206]
C84  100n  C_1206  [C_1206]
C85  100n  C_1206  [C_1206]
C86  100n  C_1206  [C_1206]
C87  100n  C_1206  [C_1206]
C88  100n  C_1206  [C_1206]
C89  100n  C_1206  [C_1206]
C90  100n  C_1206  [C_1206]
C91  100n  C_1206  [C_1206]
C92  100n  C_1206  [C_1206]
C93  100n  C_1206  [C_1206]
C94  47p  C_1206  [C_1206]
C95  47p  C_1206  [C_1206]
C96  100n  C_1206  [C_1206]
C97  4u7  C_1206  [C_1206]
C98  100n  C_1206  [C_1206]
C101  100n  C_1206  [C_1206]
C102  100n  C_1206  [C_1206]
C103  100n  C_1206  [C_1206]
C104  100n  C_1206  [C_1206]
C105  100n  C_1206  [C_1206]
C106  100n  C_1206  [C_1206]
C107  100n  C_1206  [C_1206]
C108  100n  C_1206  [C_1206]
C109  100n  C_1206  [C_1206]
C112  10u  CPOL-EUE2.5-5  [E2,5-5]
C113  10u  CPOL-EUE2.5-5  [E2,5-5]
C114  10u  CPOL-EUE2.5-5  [E2,5-5]
C115  10u  CPOL-EUE2.5-5  [E2,5-5]
CFA5  AD844_SOIC16R  [SOIC16R]
CONSTANT_SOURCES  PINHD-2X3  [2X03]
H1  MOUNT-HOLE3.0  [3,0]
H2  MOUNT-HOLE3.0  [3,0]
H3  MOUNT-HOLE3.0  [3,0]
H4  MOUNT-HOLE3.0  [3,0]
IC1  MEGA64-A  [TQFP64]
IC2  MEGA8-AI  [TQFP32-08]
IC3  FT230XS  [SSOP16]
IC_OUT  PINHD-1X4  [1X04]
INVERTORS  PINHD-2X4  [2X04]
JP62  PINHD-2X3  [2X03]
JP63  PINHD-2X3  [2X03]
JUMPER1  PINHD-1X4  [1X04]
JUMPER2  PINHD-1X4  [1X04]
JUMPER3  PINHD-1X4  [1X04]
KEYPAD  ADAFRUIT_3844  PINHD-1X8  [1X08]
NON_INVERT_AMP  PINHD-2X4  [2X04]
OA_LT1365  PINHD-1X3  [1X03]
OLED_DISP  I2C_SSH1106  PINHD-1X4  [1X04]
PROG  PINHD-2X3  [2X03]
PWL  PINHD-1X2  [1X02]
Q1  16MHz  CRYSTALHC49S  [HC49/S]
Q2  16MHz  CRYSTALHC49S  [HC49/S]
R41  10k  R_1206  [R_1206]
R54  10k  R_1206  [R_1206]
R55  10k  R_1206  [R_1206]
R56  27R  R_1206  [R_1206]
R57  27R  R_1206  [R_1206]
R58  4k7  R_1206  [R_1206]
R59  4k7  R_1206  [R_1206]
R60  10k  R_1206  [R_1206]
R61  10k  R_1206  [R_1206]
R62  10k  R_1206  [R_1206]
R63  10k  R_1206  [R_1206]
R64  10k  R_1206  [R_1206]
R65  10k  R_1206  [R_1206]
R66  10k  R_1206  [R_1206]
R67  10k  R_1206  [R_1206]
R68  10k  R_1206  [R_1206]
R69  10k  R_1206  [R_1206]
R70  10k  R_1206  [R_1206]
R71  10k  R_1206  [R_1206]
R86  EVUF3L  [EVUFXL]
R87  EVUF3L  [EVUFXL]
R88  EVUF3L  [EVUFXL]
R89  EVUF3L  [EVUFXL]
R90  EVUF3L  [EVUFXL]
R91  EVUF3L  [EVUFXL]
R92  EVUF3L  [EVUFXL]
R93  100R  R_1206  [R_1206]
R_DIG_1  MAXIM_MAX5437EUD+MAXIM_MAX5437EUD+_0_0  [MAXIM_MAX5437EUD+_0]
R_DIG_2  MAXIM_MAX5437EUD+MAXIM_MAX5437EUD+_0_0  [MAXIM_MAX5437EUD+_0]
R_DIG_IC  MAXIM_MAX5437EUD+MAXIM_MAX5437EUD+_0_0  [MAXIM_MAX5437EUD+_0]
R_DIG_PWL  MAXIM_MAX5437EUD+MAXIM_MAX5437EUD+_0_0  [MAXIM_MAX5437EUD+_0]
RDIG1  PINHD-1X2  [1X02]
RDIG2  PINHD-1X2  [1X02]
S9  320-938  [320-938]
U2  LT1365CS  [SO16]
U3  LT1365CS  [SO16]
U4  LT1365CS  [SO16]
U$1  MICRO-USBV2  [MICRO-USB-2]

### Nets
+5V: AD_OUT1.10(VCC) AD_OUT1.11(VDRIVE) AD_OUT2.10(VCC) AD_OUT2.11(VDRIVE) AD_PWL.10(VCC) AD_PWL.11(VDRIVE) C29.1 C32.1 C35.1 C36.1 C37.1 C38.1 C43.1 C44.1 C45.1 C46.1 C51.1 C52.1 C53.1 C54.1 C82.1 C83.1 C84.1 C85.1 C86.1 C87.1 C90.1 C93.1 C96.1 C97.1 IC1.21(VCC) IC1.52(VCC) IC1.64(AVCC) IC2.4(VCC) IC2.6(VCC) IC2.18(AVCC) IC3.12(VCC) OLED_DISP.2 PROG.2 R54.2 R55.2 R58.1 R59.1 R_DIG_1.14(VCC) R_DIG_2.14(VCC) R_DIG_IC.14(VCC) R_DIG_PWL.14(VCC) U$1.1(VCC) ; also sheet 1
+15V: AD_OUT1.9(VDD) AD_OUT2.9(VDD) AD_PWL.9(VDD) C26.2 C27.1 C30.1 C34.1 C39.1 C42.1 C47.1 C50.1 C55.1 C88.1 C91.1 C101.1 C103.1 C105.1 C113.+ C114.+ CFA5.14 R86.1(A) R87.1(A) R88.1(A) R_DIG_1.10(VDD) R_DIG_2.10(VDD) R_DIG_IC.4(!SHDN!) R_DIG_IC.10(VDD) R_DIG_IC.11(H) R_DIG_PWL.10(VDD) U2.4(P:V+) U3.4(P:V+) U4.4(P:V+) ; also sheet 1
-15V: AD_OUT1.6(VSS) AD_OUT2.6(VSS) AD_PWL.6(VSS) C25.2 C28.1 C31.1 C33.1 C40.1 C41.1 C48.1 C49.1 C56.1 C89.1 C92.1 C102.1 C104.1 C106.1 C112.- C115.- CFA5.7 R86.3(E) R87.3(E) R88.3(E) R_DIG_1.6(VSS) R_DIG_2.6(VSS) R_DIG_IC.6(VSS) R_DIG_IC.13(L) R_DIG_PWL.6(VSS) U2.13(P:V-) U3.13(P:V-) U4.13(P:V-) ; also sheet 1
AMP1_IN: NON_INVERT_AMP.1 U3.3(A:+IN)
AMP1_OUT: NON_INVERT_AMP.2 R91.1(A) U3.1(A:OUT)
AMP2_IN: NON_INVERT_AMP.3 U3.5(B:+IN)
AMP2_OUT: NON_INVERT_AMP.4 R89.1(A) U3.7(B:OUT)
AMP3_IN: NON_INVERT_AMP.5 U3.12(C:+IN)
AMP3_OUT: NON_INVERT_AMP.6 R92.1(A) U3.10(C:OUT)
AMP4_IN: NON_INVERT_AMP.7 U3.14(D:+IN)
AMP4_OUT: NON_INVERT_AMP.8 R90.1(A) U3.16(D:OUT)
BNC_AD_OUT_W: AD_OUT2.8(VIN1) ; also sheet 1
BNC_AD_OUT_X: AD_OUT1.7(VIN0) ; also sheet 1
BNC_AD_OUT_Y: AD_OUT1.8(VIN1) ; also sheet 1
BNC_AD_OUT_Z: AD_OUT2.7(VIN0) ; also sheet 1
CLK: JP62.3 PROG.3
CNST_SRC_1: CONSTANT_SOURCES.1 CONSTANT_SOURCES.2 U4.6(B:-IN) U4.7(B:OUT)
CNST_SRC_2: CONSTANT_SOURCES.3 CONSTANT_SOURCES.4 U4.10(C:OUT) U4.11(C:-IN)
CNST_SRC_3: CONSTANT_SOURCES.5 CONSTANT_SOURCES.6 U4.15(D:-IN) U4.16(D:OUT)
CORE_RESET: IC1.20(RESET) JP62.2 R54.1
DATA+: C94.1 R56.2 U$1.3(D+)
DATA-: C95.1 R57.2 U$1.2(D-)
FTRST: C98.1 IC3.3(VCCIO) IC3.10(3V3OUT) IC3.11(!RESET)
GND: AD_OUT1.3(DGND) AD_OUT1.4(AGND) AD_OUT1.13(DGND) AD_OUT2.3(DGND) AD_OUT2.4(AGND) AD_OUT2.13(DGND) AD_PWL.3(DGND) AD_PWL.4(AGND) AD_PWL.8(VIN1) AD_PWL.13(DGND) C25.1 C26.1 C27.2 C28.2 C29.2 C30.2 C31.2 C32.2 C33.2 C34.2 C35.2 C36.2 C37.2 C38.2 C39.2 C40.2 C41.2 C42.2 C43.2 C44.2 C45.2 C46.2 C47.2 C48.2 C49.2 C50.2 C51.2 C52.2 C53.2 C54.2 C55.2 C56.2 C57.2 C58.2 C59.2 C78.1 C79.1 C80.2 C81.2 C82.2 C83.2 C84.2 C85.2 C86.2 C87.2 C88.2 C89.2 C90.2 C91.2 C92.2 C93.2 C94.2 C95.2 C96.2 C97.2 C98.2 C101.2 C102.2 C103.2 C104.2 C105.2 C106.2 C107.2 C108.2 C109.2 C112.+ C113.- C114.- C115.+ IC1.22(GND) IC1.53(GND) IC1.63(GND) IC2.3(GND) IC2.5(GND) IC2.21(GND) IC3.5(GND) IC3.13(GND) OLED_DISP.1 PROG.1 R68.2 R69.2 R70.2 R71.2 R_DIG_1.5(GND) R_DIG_1.13(L) R_DIG_2.5(GND) R_DIG_2.13(L) R_DIG_IC.5(GND) R_DIG_PWL.4(!SHDN!) R_DIG_PWL.5(GND) R_DIG_PWL.12(W) R_DIG_PWL.13(L) S9.1(1:O) S9.6(B:S) U2.3(A:+IN) U2.5(B:+IN) U2.12(C:+IN) U2.14(D:+IN) U$1.5(GND) U$1.P$1(GND) U$1.P$2(GND) U$1.P$3(GND) U$1.P$4(GND) ; also sheet 1
I2C_CORE_SCL: IC1.25((SCL/INT0)PD0) OLED_DISP.3 R59.2
I2C_CORE_SDA: IC1.26((SDA/INT1)PD1) OLED_DISP.4 R58.2
INV1_IN: INVERTORS.1 R60.2
INV1_OUT: INVERTORS.2 R61.1 U2.1(A:OUT)
INV2_IN: INVERTORS.3 R62.2
INV2_OUT: INVERTORS.4 R63.1 U2.7(B:OUT)
INV3_IN: INVERTORS.5 R64.2
INV3_OUT: INVERTORS.6 R65.1 U2.10(C:OUT)
INV4_IN: INVERTORS.7 R66.2
INV4_OUT: INVERTORS.8 R67.1 U2.16(D:OUT)
KEYPAD_C1: IC1.35((A8)PC0) KEYPAD.1
KEYPAD_C2: IC1.36((A9)PC1) KEYPAD.2
KEYPAD_C3: IC1.37((A10)PC2) KEYPAD.3
KEYPAD_C4: IC1.38((A11)PC3) KEYPAD.4
KEYPAD_R1: IC1.39((A12)PC4) KEYPAD.5
KEYPAD_R2: IC1.40((A13)PC5) KEYPAD.6
KEYPAD_R3: IC1.41((A14)PC6) KEYPAD.7
KEYPAD_R4: IC1.42((A15)PC7) KEYPAD.8
N$5: R93.1 R_DIG_PWL.11(H)
N$7: OA_LT1365.3 U4.3(A:+IN)
N$16: CFA5.5 S9.5(B:P)
N$49: R68.1 R91.2(S) R91.3(E) U3.2(A:-IN)
N$58: R69.1 R89.2(S) R89.3(E) U3.6(B:-IN)
N$63: CFA5.3 R41.2
N$81: R41.1 S9.2(1:P)
N$87: R70.1 R92.2(S) R92.3(E) U3.11(C:-IN)
N$93: OA_LT1365.2 U4.2(A:-IN)
N$105: C107.1 R86.2(S) U4.5(B:+IN)
N$111: OA_LT1365.1 U4.1(A:OUT)
N$130: R71.1 R90.2(S) R90.3(E) U3.15(D:-IN)
N$131: C109.1 R88.2(S) U4.14(D:+IN)
N$132: R_DIG_IC.9(IN+) R_DIG_IC.12(W)
N$134: IC_OUT.1 IC_OUT.2 IC_OUT.3 IC_OUT.4 R_DIG_IC.7(OUT) R_DIG_IC.8(IN-)
N$135: C108.1 R87.2(S) U4.12(C:+IN)
N$136: CFA5.11 R93.2
N$137: JUMPER1.1 JUMPER1.2 JUMPER1.3 JUMPER1.4
N$138: AD_PWL.5(REFIN/OUT) C57.1
N$139: AD_OUT1.5(REFIN/OUT) C58.1
N$140: AD_OUT2.5(REFIN/OUT) C59.1
N$151: JUMPER2.1 JUMPER2.2 JUMPER2.3 JUMPER2.4
N$152: JUMPER3.1 JUMPER3.2 JUMPER3.3 JUMPER3.4
N$192: C80.1 IC2.7(PB6(XTAL1/TOSC1)) Q2.2
N$193: C81.1 IC2.8(PB7(XTAL2/TOSC2)) Q2.1
N$194: C78.2 IC1.23(XTAL2) Q1.2
N$195: C79.2 IC1.24(XTAL1) Q1.1
N$196: R_DIG_1.11(H) RDIG1.1
N$197: R_DIG_1.12(W) RDIG1.2
N$198: R_DIG_2.11(H) RDIG2.1
N$199: R_DIG_2.12(W) RDIG2.2
N$200: IC3.8(USBDP) R56.1
N$201: IC3.9(USBDM) R57.1
N$205: R60.1 R61.2 U2.2(A:-IN)
N$209: R62.1 R63.2 U2.6(B:-IN)
N$213: R66.1 R67.2 U2.15(D:-IN)
N$214: R64.1 R65.2 U2.11(C:-IN)
PDI: JP63.3 PROG.4
PDO: JP63.4 PROG.6
PWL_IN: AD_PWL.7(VIN0) PWL.1 S9.3(1:S) S9.4(B:O)
PWL_OUT: CFA5.12 PWL.2
PWL_RESET: IC2.29(PC6(/RESET)) JP62.6 R55.1
RST: JP62.4 PROG.5
SPI_CORE_CS_IC: IC1.29((IC1)PD4) R_DIG_IC.3(!CS!)
SPI_CORE_CS_OUT1: AD_OUT1.1(!CS!) IC1.30((XCK1)PD5)
SPI_CORE_CS_OUT2: AD_OUT2.1(!CS!) IC1.31((T1)PD6)
SPI_CORE_CS_R1: IC1.32((T2)PD7) R_DIG_1.3(!CS!)
SPI_CORE_CS_R2: IC1.14((OC0)PB4) R_DIG_2.3(!CS!)
SPI_CORE_MISO: AD_OUT1.12(DOUT) AD_OUT2.12(DOUT) IC1.13((MISO)PB3)
SPI_CORE_MOSI: AD_OUT1.2(DIN) AD_OUT2.2(DIN) IC1.12((MOSI)PB2) R_DIG_1.2(DIN) R_DIG_2.2(DIN) R_DIG_IC.2(DIN)
SPI_CORE_SCLK: AD_OUT1.14(SCLK) AD_OUT2.14(SCLK) IC1.11((SCK)PB1) JP62.1 R_DIG_1.1(SCLK) R_DIG_2.1(SCLK) R_DIG_IC.1(SCLK)
SPI_PWL_CS_AD: AD_PWL.1(!CS!) IC2.12(PB0(ICP))
SPI_PWL_CS_R_DIG: IC2.13(PB1(OC1A)) R_DIG_PWL.3(!CS!)
SPI_PWL_MISO: AD_PWL.12(DOUT) IC2.16(PB4(MISO)) JP63.6
SPI_PWL_MOSI: AD_PWL.2(DIN) IC2.15(PB3(MOSI/OC2)) JP63.5 R_DIG_PWL.2(DIN)
SPI_PWL_SCLK: AD_PWL.14(SCLK) IC2.17(PB5(SCK)) JP62.5 R_DIG_PWL.1(SCLK)
UART_PC_RX_TX: IC1.2((RXD/PDI)PE0) IC3.1(TXD) JP63.1
UART_PC_TX_RX: IC1.3((TXD/PDO)PE1) IC3.4(RXD) JP63.2
UART_PWL_RX_TX: IC1.27((RXD1/INT2)PD2) IC2.31(PD1(TXD))
UART_PWL_TX_RX: IC1.28((TXD1/INT3)PD3) IC2.30(PD0(RXD))
Unconnected: CFA5.2 CFA5.15 IC1.1(PEN) IC1.4((XCK0/AIN0)PE2) IC1.5((OC3A/AIN1)PE3) IC1.6((OC3B/INT4)PE4) IC1.7((OC3C/INT5)PE5) IC1.8((T3/INT6)PE6) IC1.9((IC3/INT7)PE7) IC1.10((SS)PB0) IC1.15((OC1A)PB5) IC1.16((OC1B)PB6) IC1.17((OC2/OC1C)PB7) IC1.18(PG3(TOSC2)) IC1.19(PG4(TOSC1)) IC1.33(PG0(WR)) IC1.34(PG1(RD)) IC1.43(PG2(ALE)) IC1.44((AD7)PA7) IC1.45((AD6)PA6) IC1.46((AD5)PA5) IC1.47((AD4)PA4) IC1.48((AD3)PA3) IC1.49((AD2)PA2) IC1.50((AD1)PA1) IC1.51((AD0)PA0) IC1.54(PF7(ADC7/TDI)) IC1.55(PF6(ADC6/TDO)) IC1.56(PF5(ADC5/TMS)) IC1.57(PF4(ADC4/TCK)) IC1.58(PF3(ADC3)) IC1.59(PF2(ADC2)) IC1.60(PF1(ADC1)) IC1.61(PF0(ADC0)) IC1.62(AREF) IC2.1(PD3(INT1)) IC2.2(PD4(XCK/T0)) IC2.9(PD5(T1)) IC2.10(PD6(AIN0)) IC2.11(PD7(AIN1)) IC2.14(PB2(SS/OC1B)) IC2.19(ADC6) IC2.20(AREF) IC2.22(ADC7) IC2.23(PC0(ADC0)) IC2.24(PC1(ADC1)) IC2.25(PC2(ADC2)) IC2.26(PC3(ADC3)) IC2.27(PC4(ADC4/SDA)) IC2.28(PC5(ADC5/SCL)) IC2.32(PD2(INT0)) IC3.2(!RTS) IC3.6(!CTS) IC3.7(CBUS2) IC3.14(CBUS1) IC3.15(CBUS0) IC3.16(CBUS3) R_DIG_1.4(!SHDN!) R_DIG_1.7(OUT) R_DIG_1.8(IN-) R_DIG_1.9(IN+) R_DIG_2.4(!SHDN!) R_DIG_2.7(OUT) R_DIG_2.8(IN-) R_DIG_2.9(IN+) R_DIG_PWL.7(OUT) R_DIG_PWL.8(IN-) R_DIG_PWL.9(IN+) U$1.4(ID)

### Notes on the sheet
- PWL BLOCK | DIGITAL PROCESSING
- INVERTORS | AMPLIFIERS
- CONSTANT SOURCES
- IC BLOCK | DIGITAL POTENTIOMETERS | DIGITAL IN/OUT
- PROGRAMMER
- ANALOG PART 2, DIGITAL PART

## Library data of the parts
AD_OUT1 AD_OUT2 AD_PWL = my_lib:AD7322: Analog Devices AD7322, AD Converter
C1-C109 = my_lib:C: CAPACITOR, European symbol
C110-C115 = rcl:CPOL-EU: POLARIZED CAPACITOR, European symbol
C_EXT_W C_EXT_X C_EXT_Y C_EXT_Z IC_IN_W IC_IN_X IC_IN_Y IC_IN_Z IN_INTEG_W IN_INTEG_X IN_INTEG_Y IN_INTEG_Z JP27-JP42 PWL R_EXT_W R_EXT_X R_EXT_Y R_EXT_Z RDIG1 RDIG2 = pinhead:PINHD-1X2: PIN HEADER
CFA1-CFA5 = my_lib:AD844: Analog Devices AD844, Current Feedback Amplifier / Current Conveyour
CONSTANT_SOURCES JP62 JP63 PROG = pinhead:PINHD-2X3: PIN HEADER
D1 D2 = my_lib:TRANSIL: TRANSIL controlled avalanche rectifier
F1 F2 = my_lib:FUSE: FUSE, European symbol
H1-H4 = holes:MOUNT-HOLE: MOUNTING HOLE with drill center marker
IC1 = atmel:MEGA64: MICROCONTROLLER 64 Kbytes FLASH 4 Kbytes SRAM 2 Kbytes EEPROM DUAL USART 8-channel 10 bit ADC Source: avr.lbr; MPN: ATMEGA64-16AU; OC_FARNELL: 9171355; OC_NEWARK: 01M6899
IC2 = atmel:MEGA8: MICROCONTROLLER 8 Kbytes FLASH, 1 kbytes SRAM, 512 bytes EEPROM, USART, 6-channel 10 bit ADC, 2-channel 8 bit ADC Pin compatible with Atmega48, ATMega88, ATMega168 Source: avr.lbr; MPN: ATMEGA8-16AU; OC_FARNELL: 9171371; OC_NEWARK: 73M8863
IC3 = ftdichip:FT230X: USB to BASIC UART IC Auto generated by make-symbol-device-package-bsdl.ulp Rev. 43 Source: Data sheet <http://www.ftdichip.com/Support/Documents/DataSheets/ICs/DS_FT230X.pdf>
IC4 = v-reg:78MXXS: VOLTAGE REGULATOR
IC_OUT JUMPER1-JUMPER3 MULT_OUT_1-MULT_OUT_8 OLED_DISP = pinhead:PINHD-1X4: PIN HEADER
INTEG_OUT_W INTEG_OUT_X INTEG_OUT_Y INTEG_OUT_Z = pinhead:PINHD-2X10: PIN HEADER
INVERTORS MULT_IN_1-MULT_IN_8 NON_INVERT_AMP = pinhead:PINHD-2X4: PIN HEADER
KEYPAD SUM_IN_W SUM_IN_X SUM_IN_Y SUM_IN_Z = pinhead:PINHD-1X8: PIN HEADER
MLT1-MLT8 = my_lib:AD633: Analog Devices AD633, Four-quadrant analog multiplier
OA_LT1365 PWR = pinhead:PINHD-1X3: PIN HEADER
Q1 Q2 = crystal:CRYSTAL: CRYSTAL; OC_FARNELL: 1667008; OC_NEWARK: unknown
R1-R4 R42-R53 = rcl:R-TRIMM: Trimm resistor; SPICEMODEL: X; SPICEPREFIXL: POT
R5-R41 R54-R73 R93-R97 = my_lib:R: RESISTOR, European symbol
R74-R92 = pot:EVU: 9 mm Square Rotary Potentiometers Source: Panasonic
R_DIG_1 R_DIG_2 R_DIG_IC R_DIG_PWL = my_lib:MAXIM_MAX5437EUD+: MAX5437-U14X1; CIIVA_IDS: 1072639; CODE__JEDEC: MO-153; COMPONENT_LINK_1_DESCRIPTION: Manufacturer URL; COMPONENT_LINK_1_URL: http://www.maximintegrated.com/; COMPONENT_LINK_3_DESCRIPTION: Package Specification; COMPONENT_LINK_3_URL: http://pdfserv.maximintegrated.com/package_dwgs/21-0066.PDF; CONTROL_INTERFACE: 3-Wire Serial SPI; DATASHEET: http://datasheets.maximintegrated.com/en/ds/MAX5436-MAX5439.pdf; DATASHEET_VERSION: Rev. 3; FEATURES: On-Chip Uncommitted Op Amp; FOOTPRINT_VARIANT_NAME_0: Level C; FOOTPRINT_VARIANT_NAME_1: Level B; FOOTPRINT_VARIANT_NAME_2: Level A; IMPORTED: yes; IMPORTED_FROM: vault; IMPORT_TS: 1521859771; MF: Maxim; MOUNTING_TECHNOLOGY: Surface Mount; MPN: MAX5437EUD+; PACKAGE: U14+1; PACKAGE_DESCRIPTION: 14-Pin Thin Shrink Small-Outline Package (U14+1), Body 5 x 4.4 mm, Pitch 0.65 mm; PACKAGE_VERSION: Rev. L, 07/2010; PIN_0_0_0_INSIDE_EDGE: clock; PREFIX: U; RELEASE_DATE: 1372529079; VAULT_GUID: ABCEC224-AEAD-4FB5-AC11-C0E73908672B; VAULT_REVISION: 0088D254-FA46-48E2-BA67-D106F9F07E90
S1-S4 = my_lib:KC25A9.501NLS: Rotary switch
S5-S9 = switch:320-938: TOGGLE SWITCH distributor RS Components
SUM_OUT_W SUM_OUT_X SUM_OUT_Y SUM_OUT_Z = pinhead:PINHD-1X1: PIN HEADER
U1-U4 = my_lib:LT1365: Dual and Quad 70MHz, 1000V/μs Op Amps Datasheet: LTC1364-1365 <http://cds.linear.com/docs/en/datasheet/13645fa.pdf>
U$1 = microusb:MICRO-USB: Micro USB B connector
U$2 = my_lib:IRF1010: N-MOSFET
U$3 = my_lib:IRF5305: P-MOSFET
U$4 = my_lib:7401P3D9CQES: 4 pole switch ON-NONE-ON
X1-X8 = con-coax:BN35N61: BNC CONNECTOR M/A COM www.macom.com distributor Farnell 149-452; OC_FARNELL: unknown; OC_NEWARK: unknown